# Altium schematic sheet POWER_CON.SchDoc
size 420 x 297 mm; SheetNumber: 15; SheetTotal: 19
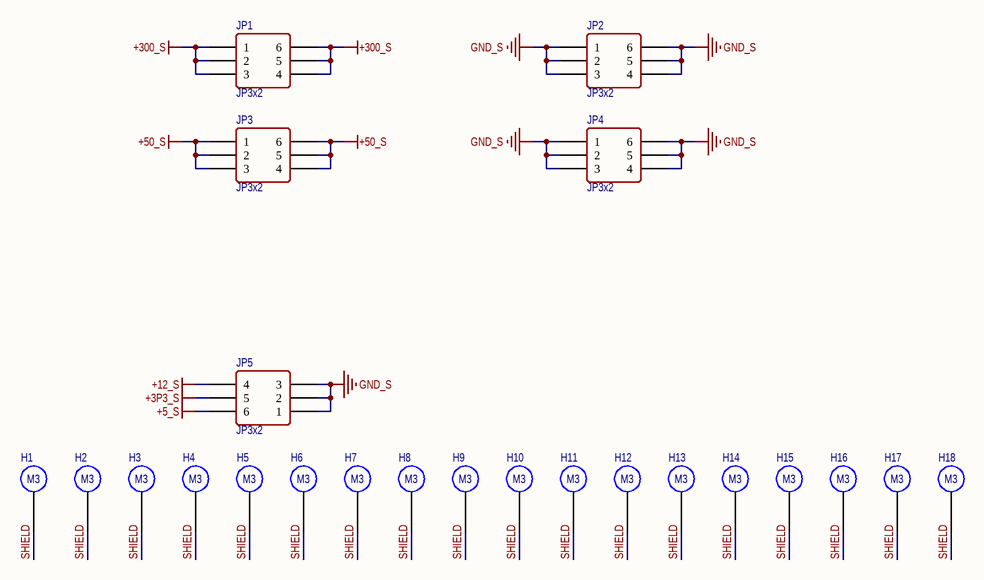
[diagram p0: POWER_CON.SchDoc]

## Parts
H1  M3  [M3]  (no BOM)
H2  M3  [M3]  (no BOM)
H3  M3  [M3]  (no BOM)
H4  M3  [M3]  (no BOM)
H5  M3  [M3]  (no BOM)
H6  M3  [M3]  (no BOM)
H7  M3  [M3]  (no BOM)
H8  M3  [M3]  (no BOM)
H9  M3  [M3]  (no BOM)
H10  M3  [M3]  (no BOM)
H11  M3  [M3]  (no BOM)
H12  M3  [M3]  (no BOM)
H13  M3  [M3]  (no BOM)
H14  M3  [M3]  (no BOM)
H15  M3  [M3]  (no BOM)
H16  M3  [M3]  (no BOM)
H17  M3  [M3]  (no BOM)
H18  M3  [M3]  (no BOM)
JP1  JP3x2  [JP3-C2T]
JP2  JP3x2  [JP3-C2T]
JP3  JP3x2  [JP3-C2T]
JP4  JP3x2  [JP3-C2T]
JP5  JP3x2  [JP3-C2T]

## Nets
+3P3_S: JP5.5
+5_S: JP5.6
+12_S: JP5.4
+50_S: JP3.1 JP3.2 JP3.3 JP3.4 JP3.5 JP3.6
+300_S: JP1.1 JP1.2 JP1.3 JP1.4 JP1.5 JP1.6
GND_S: JP2.1 JP2.2 JP2.3 JP2.4 JP2.5 JP2.6 JP4.1 JP4.2 JP4.3 JP4.4 JP4.5 JP4.6 JP5.1 JP5.2 JP5.3
SHIELD: H1.1 H2.1 H3.1 H4.1 H5.1 H6.1 H7.1 H8.1 H9.1 H10.1 H11.1 H12.1 H13.1 H14.1 H15.1 H16.1 H17.1 H18.1

## Notes on the sheet
- Project:
- Sub-system:
- Design by:
- Sheet title:
- Sheet
- of
- Checked by:
- Approved by:
- Document No:
- Revision:
- Size:
- Date:

## Library data of the parts
JP1-JP5 = JP3x2: CONN RCPT 6POS 0.1 GOLD PCB; Manufacturer: W¨¹rth Elektronik eiSos GmbH; partNo: 61300621821; ComponentLink1 Description: Manufacturer; ComponentLink2 Description: Datasheet; PN: 5-534206-3; Created Date: 29 March 2013; ComponentLink1URL: http://www.we-online.com; ComponentLink2URL: http://katalog.we-online.de/em/datasheet/6130xx21821.pdf; Created by: Karrer Zheng